# EAGLE schematic dabling (EAGLE 6.5.0)
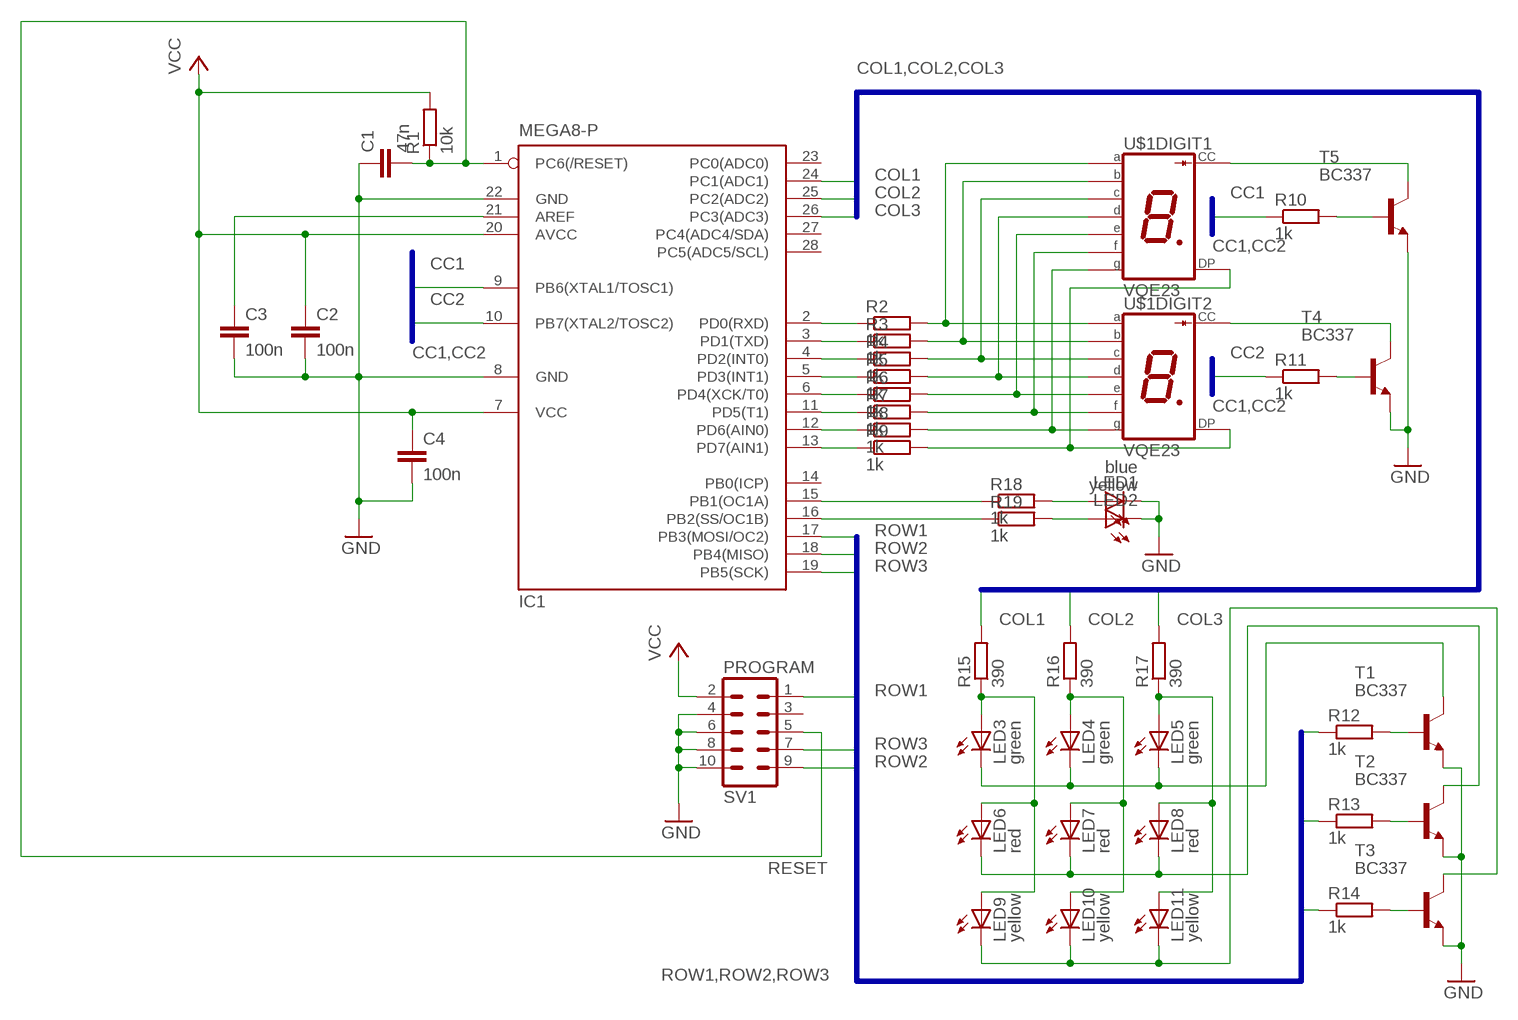
[diagram p0: schematic, sheet 1]

## Parts
C1  47n  C-EU050-024X044  [C050-024X044]
C2  100n  C-EU050-024X044  [C050-024X044]
C3  100n  C-EU050-024X044  [C050-024X044]
C4  100n  C-EU050-024X044  [C050-024X044]
IC1  MEGA8-P  [DIL28-3]
LED1  blue  LED5MM  [LED5MM]
LED2  yellow  LED5MM  [LED5MM]
LED3  green  LED3MM  [LED3MM]
LED4  green  LED3MM  [LED3MM]
LED5  green  LED3MM  [LED3MM]
LED6  red  LED3MM  [LED3MM]
LED7  red  LED3MM  [LED3MM]
LED8  red  LED3MM  [LED3MM]
LED9  yellow  LED3MM  [LED3MM]
LED10  yellow  LED3MM  [LED3MM]
LED11  yellow  LED3MM  [LED3MM]
R1  10k  R-EU_0204/2V  [0204V]
R2  1k  R-EU_0204/2V  [0204V]
R3  1k  R-EU_0204/2V  [0204V]
R4  1k  R-EU_0204/2V  [0204V]
R5  1k  R-EU_0204/2V  [0204V]
R6  1k  R-EU_0204/2V  [0204V]
R7  1k  R-EU_0204/2V  [0204V]
R8  1k  R-EU_0204/2V  [0204V]
R9  1k  R-EU_0204/2V  [0204V]
R10  1k  R-EU_0204/2V  [0204V]
R11  1k  R-EU_0204/2V  [0204V]
R12  1k  R-EU_0204/2V  [0204V]
R13  1k  R-EU_0204/2V  [0204V]
R14  1k  R-EU_0204/2V  [0204V]
R15  390  R-EU_0204/2V  [0204V]
R16  390  R-EU_0204/2V  [0204V]
R17  390  R-EU_0204/2V  [0204V]
R18  1k  R-EU_0204/2V  [0204V]
R19  1k  R-EU_0204/2V  [0204V]
SV1  PROGRAM  ML10  [ML10]
T1  BC337  [TO92]
T2  BC337  [TO92]
T3  BC337  [TO92]
T4  BC337  [TO92]
T5  BC337  [TO92]
U$1  VQE23  [PKG_VQE_X1-X4]

## Nets
CC1: IC1.9(PB6(XTAL1/TOSC1)) R10.1
CC2: IC1.10(PB7(XTAL2/TOSC2)) R11.1
COL1: IC1.24(PC1(ADC1)) R15.2
COL2: IC1.25(PC2(ADC2)) R16.2
COL3: IC1.26(PC3(ADC3)) R17.2
GND: C1.1 C2.2 C3.2 C4.2 IC1.8(GND) IC1.22(GND) LED1.K(C) LED2.K(C) SV1.4 SV1.6 SV1.8 SV1.10 T1.1(E) T2.1(E) T3.1(E) T4.1(E) T5.1(E)
N$1: R12.2 T1.2(B)
N$2: R13.2 T2.2(B)
N$3: R14.2 T3.2(B)
N$4: IC1.2(PD0(RXD)) R2.1
N$5: IC1.3(PD1(TXD)) R3.1
N$6: IC1.4(PD2(INT0)) R4.1
N$7: IC1.5(PD3(INT1)) R5.1
N$8: IC1.6(PD4(XCK/T0)) R6.1
N$9: IC1.11(PD5(T1)) R7.1
N$10: IC1.12(PD6(AIN0)) R8.1
N$11: IC1.13(PD7(AIN1)) R9.1
N$12: R2.2 U$1.11(DIGIT2:A) U$1.16(DIGIT1:A)
N$13: R3.2 U$1.13(DIGIT2:B) U$1.14(DIGIT1:B)
N$14: R4.2 U$1.1(DIGIT1:C) U$1.8(DIGIT2:C)
N$15: R5.2 U$1.3(DIGIT1:D) U$1.6(DIGIT2:D)
N$16: R6.2 U$1.2(DIGIT1:E) U$1.7(DIGIT2:E)
N$17: R7.2 U$1.12(DIGIT2:F) U$1.15(DIGIT1:F)
N$18: R8.2 U$1.10(DIGIT2:G) U$1.17(DIGIT1:G)
N$19: R9.2 U$1.9(DIGIT2:DP) U$1.18(DIGIT1:DP)
N$20: T4.3(C) U$1.5(DIGIT2:CC)
N$21: T5.3(C) U$1.4(DIGIT1:CC)
N$22: LED3.A LED6.A LED9.A R15.1
N$23: R11.2 T4.2(B)
N$24: R10.2 T5.2(B)
N$25: LED4.A LED7.A LED10.A R16.1
N$26: LED5.A LED8.A LED11.A R17.1
N$27: C3.1 IC1.21(AREF)
N$30: LED1.A R18.2
N$31: LED2.A R19.2
N$32: IC1.15(PB1(OC1A)) R18.1
N$33: IC1.16(PB2(SS/OC1B)) R19.1
RESET: C1.2 IC1.1(PC6(/RESET)) R1.1 SV1.5
ROW1: IC1.17(PB3(MOSI/OC2)) R12.1 SV1.1
ROW2: IC1.18(PB4(MISO)) R13.1 SV1.9
ROW3: IC1.19(PB5(SCK)) R14.1 SV1.7
ROWCOLLECTOR1: LED3.K(C) LED4.K(C) LED5.K(C) T1.3(C)
ROWCOLLECTOR2: LED6.K(C) LED7.K(C) LED8.K(C) T2.3(C)
ROWCOLLECTOR3: LED9.K(C) LED10.K(C) LED11.K(C) T3.3(C)
VCC: C2.1 C4.1 IC1.7(VCC) IC1.20(AVCC) R1.2 SV1.2
Unconnected: IC1.14(PB0(ICP)) IC1.23(PC0(ADC0)) IC1.27(PC4(ADC4/SDA)) IC1.28(PC5(ADC5/SCL)) SV1.3

## Buses
COL1,COL2,COL3
CC1,CC2
ROW1,ROW2,ROW3

## Library data of the parts
C1-C4 = rcl:C-EU: CAPACITOR, European symbol
IC1 = atmel:MEGA8-P: MICROCONTROLLER 8 Kbytes FLASH, 1 kbytes SRAM, 512 bytes EEPROM, USART, 4-channel 10 bit ADC, 2-channel 8 bit ADC Pin compatible with Atmega48, ATMega88, ATMega168 Source: avr.lbr; OC_FARNELL: unknown; OC_NEWARK: unknown
LED1-LED11 = led:LED: LED OSRAM: - CHIPLED LG R971, LG N971, LY N971, LG Q971, LY Q971, LO R971, LY R971 LH N974, LH R974 LS Q976, LO Q976, LY Q976 LO Q996 - Hyper CHIPLED LW Q18S LB Q993, LB Q99A, LB R99A - SideLED LS A670, LO A670, LY A670, LG A670, LP A670 LB A673, LV A673, LT A673, LW A673 LH A674 LY A675 LS A676, LA A676, LO A676, LY A676, LW A676 LS A679, LY A679, LG A679 - Hyper Micro SIDELED® LS Y876, LA Y876, LO Y876, LY Y876 LT Y87S - SmartLED LW L88C, LW L88S LB L89C, LB L89S, LG L890 LS L89K, LO L89K, LY L89K LS L896, LA L896, LO L896, LY L896 - TOPLED LS T670, LO T670, LY T670, LG T670, LP T670 LSG T670, LSP T670, LSY T670, LOP T670, LYG T670 LG T671, LOG T671, LSG T671 LB T673, LV T673, LT T673, LW T673 LH T674 LS T676, LA T676, LO T676, LY T676, LB T676, LH T676, LSB T676, LW T676 LB T67C, LV T67C, LT T67C, LS T67K, LO T67K, LY T67K, LW E67C LS E67B, LA E67B, LO E67B, LY E67B, LB E67C, LV E67C, LT E67C LW T67C LS T679, LY T679, LG T679 LS T770, LO T770, LY T770, LG T770, LP T770 LB T773, LV T773, LT T773, LW T773 LH T774 LS E675, LA E675, LY E675, LS T675 LS T776, LA T776, LO T776, LY T776, LB T776 LHGB T686 LT T68C, LB T68C - Hyper Mini TOPLED® LB M676 - Mini TOPLED Santana® LG M470 LS M47K, LO M47K, LY M47K Source: http://www.osram.convergy.de LUXEON: - LUMILED® LXK2-PW12-R00, LXK2-PW12-S00, LXK2-PW14-U00, LXK2-PW14-V00 LXK2-PM12-R00, LXK2-PM12-S00, LXK2-PM14-U00 LXK2-PE12-Q00, LXK2-PE12-R00, LXK2-PE12-S00, LXK2-PE14-T00, LXK2-PE14-U00 LXK2-PB12-K00, LXK2-PB12-L00, LXK2-PB12-M00, LXK2-PB14-N00, LXK2-PB14-P00, LXK2-PB14-Q00 LXK2-PR12-L00, LXK2-PR12-M00, LXK2-PR14-Q00, LXK2-PR14-R00 LXK2-PD12-Q00, LXK2-PD12-R00, LXK2-PD12-S00 LXK2-PH12-R00, LXK2-PH12-S00 LXK2-PL12-P00, LXK2-PL12-Q00, LXK2-PL12-R00 Source: www.luxeon.com KINGBRIGHT: KA-3528ASYC Source: www.kingbright.com
R1-R19 = resistor:R-EU_: RESISTOR, European symbol
SV1 = con-harting-ml:ML10: HARTING; OC_FARNELL: unknown; OC_NEWARK: unknown
T1-T5 = transistor:BC337: NPN TRANSISTOR
U$1 = Rft-opto:VQE23: VQE23 RFT VQE 23 (2 stellige 7-Segment-Anzeige mit gemeinsamer Katode, grünstrahlend) nach TGL 39352.